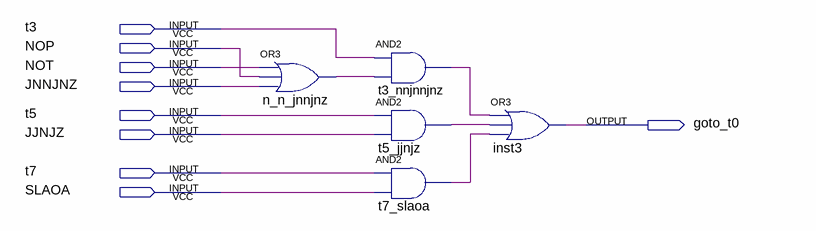
[diagram p0: schematic sheet]
// Quartus schematic goto_t0.bdf as structural Verilog: 5 symbols, 9 pins
module goto_t0 (
  input  t3,
  input  NOP,
  input  NOT,
  input  JNNJNZ,
  input  t5,
  input  JJNJZ,
  input  t7,
  input  SLAOA,
  output goto_t0
);

  wire n_n_jnnjnz_out, t3_nnjnnjnz_out, t5_jjnjz_out, t7_slaoa_out;

  or n_n_jnnjnz (n_n_jnnjnz_out, NOT, NOP, JNNJNZ);
  and t3_nnjnnjnz (t3_nnjnnjnz_out, t3, n_n_jnnjnz_out);
  and t5_jjnjz (t5_jjnjz_out, t5, JJNJZ);
  and t7_slaoa (t7_slaoa_out, t7, SLAOA);
  or inst3 (goto_t0, t3_nnjnnjnz_out, t5_jjnjz_out, t7_slaoa_out);
endmodule
